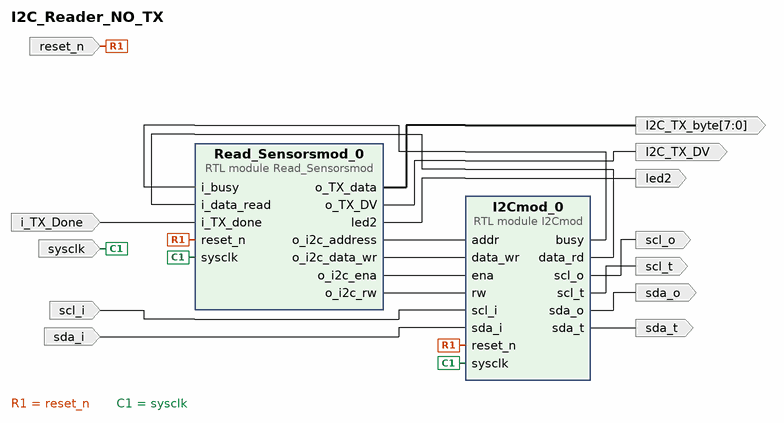
[diagram p0: block diagram of the top level]
# Vivado block design I2C_Reader_NO_TX, xc7a35tcpg236-1, Vivado 2024.2
create_bd_design I2C_Reader_NO_TX

create_bd_port -dir I reset_n
create_bd_port -dir I sda_i
create_bd_port -dir I scl_i
create_bd_port -dir I sysclk
create_bd_port -dir O sda_o
create_bd_port -dir O sda_t
create_bd_port -dir O scl_o
create_bd_port -dir O scl_t
create_bd_port -dir O led2
create_bd_port -dir O -from 7 -to 0 I2C_TX_byte
create_bd_port -dir O I2C_TX_DV
create_bd_port -dir I i_TX_Done

create_bd_cell -type module -reference I2Cmod I2Cmod_0
create_bd_cell -type module -reference Read_Sensorsmod Read_Sensorsmod_0

# ---- connections ----

connect_bd_net [get_bd_pins I2Cmod_0/busy] [get_bd_pins Read_Sensorsmod_0/i_busy]
connect_bd_net [get_bd_pins I2Cmod_0/data_rd] [get_bd_pins Read_Sensorsmod_0/i_data_read]
connect_bd_net [get_bd_pins I2Cmod_0/scl_o] [get_bd_ports scl_o]
connect_bd_net [get_bd_pins I2Cmod_0/scl_t] [get_bd_ports scl_t]
connect_bd_net [get_bd_pins I2Cmod_0/sda_o] [get_bd_ports sda_o]
connect_bd_net [get_bd_pins I2Cmod_0/sda_t] [get_bd_ports sda_t]
connect_bd_net [get_bd_pins Read_Sensorsmod_0/led2] [get_bd_ports led2]
connect_bd_net [get_bd_pins Read_Sensorsmod_0/o_TX_DV] [get_bd_ports I2C_TX_DV]
connect_bd_net [get_bd_pins Read_Sensorsmod_0/o_TX_data] [get_bd_ports I2C_TX_byte]
connect_bd_net [get_bd_pins Read_Sensorsmod_0/o_i2c_address] [get_bd_pins I2Cmod_0/addr]
connect_bd_net [get_bd_pins Read_Sensorsmod_0/o_i2c_data_wr] [get_bd_pins I2Cmod_0/data_wr]
connect_bd_net [get_bd_pins Read_Sensorsmod_0/o_i2c_ena] [get_bd_pins I2Cmod_0/ena]
connect_bd_net [get_bd_pins Read_Sensorsmod_0/o_i2c_rw] [get_bd_pins I2Cmod_0/rw]
connect_bd_net [get_bd_ports i_TX_Done] [get_bd_pins Read_Sensorsmod_0/i_TX_done]
connect_bd_net [get_bd_ports reset_n] [get_bd_pins I2Cmod_0/reset_n] [get_bd_pins Read_Sensorsmod_0/reset_n]
connect_bd_net [get_bd_ports scl_i] [get_bd_pins I2Cmod_0/scl_i]
connect_bd_net [get_bd_ports sda_i] [get_bd_pins I2Cmod_0/sda_i]
connect_bd_net [get_bd_ports sysclk] [get_bd_pins I2Cmod_0/sysclk] [get_bd_pins Read_Sensorsmod_0/sysclk]

validate_bd_design
save_bd_design
